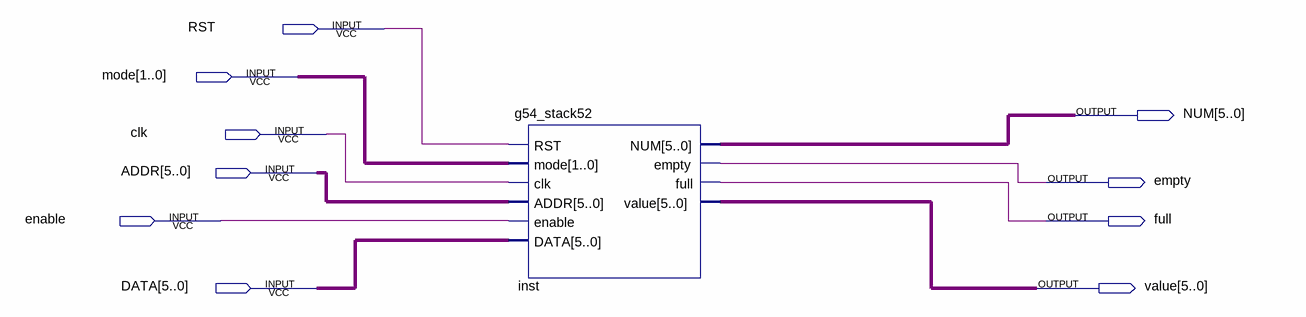
[diagram p0: schematic sheet]
// Quartus schematic g54_stack52BLOCK.bdf as structural Verilog: 1 symbols, 10 pins
module g54_stack52BLOCK (
  input  RST,
  input  [1:0] mode,
  input  clk,
  input  [5:0] ADDR,
  input  enable,
  input  [5:0] DATA,
  output [5:0] NUM,
  output empty,
  output full,
  output [5:0] value
);

  g54_stack52 inst (
    .RST(RST), .mode(mode), .clk(clk), .ADDR(ADDR), .enable(enable), .DATA(DATA), .NUM(NUM), .empty(empty),
    .full(full), .value(value));
endmodule
